# Altium project PCB_Components.PrjPCB
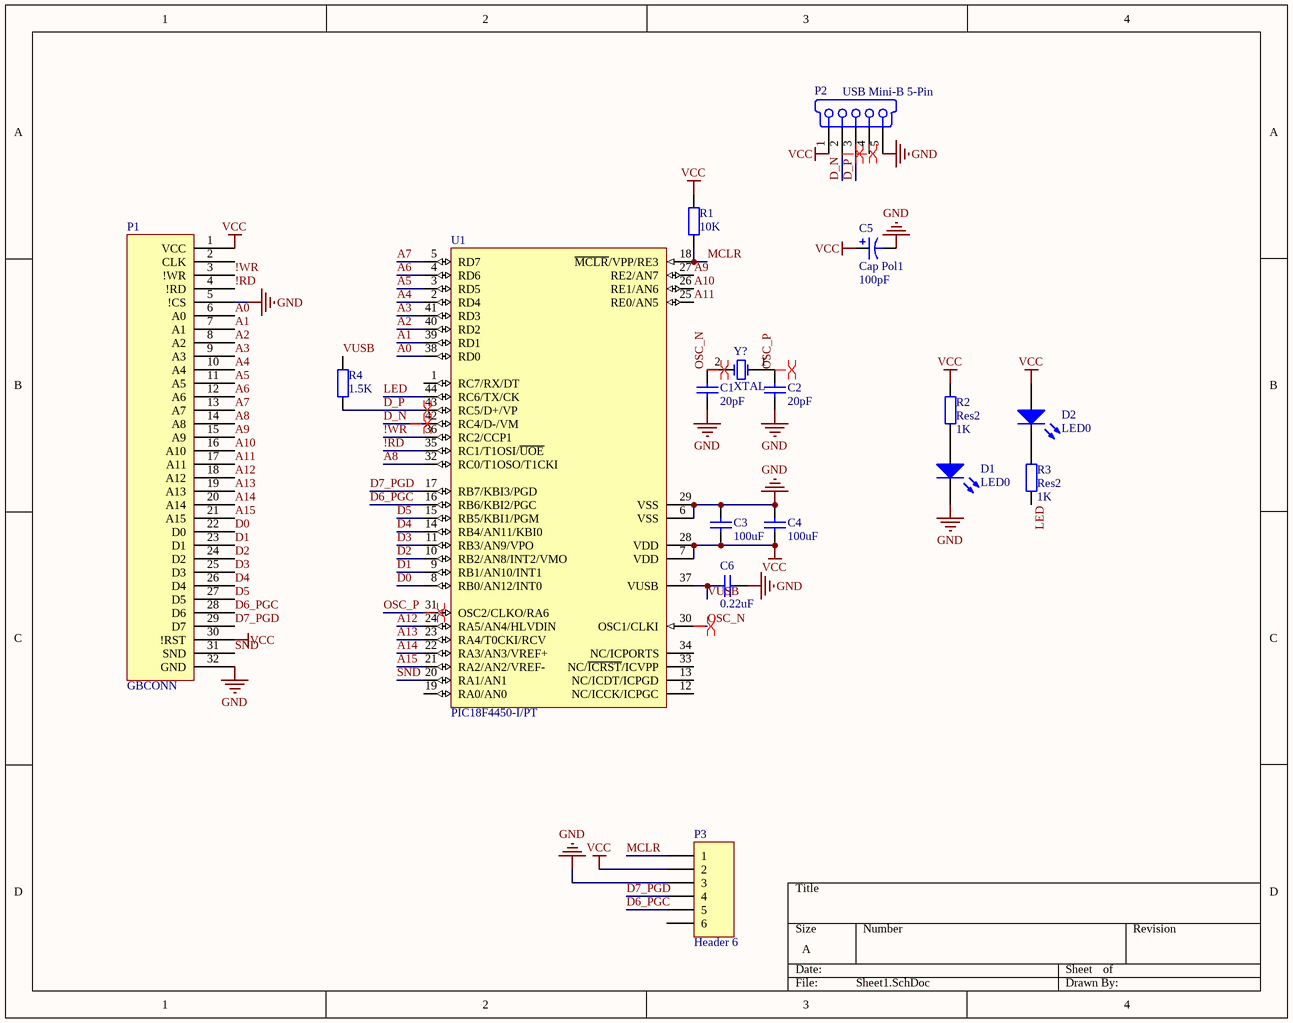
[diagram p0: Sheet1.SchDoc]
1 sheet, 17 parts. Net scope: global (net labels, ports and power ports of the same name join across sheets).
Board file: PCB.PcbDoc

## Sheet Sheet1.SchDoc
size A

### Parts
C1  value 20pF  [6-0805_N]  (hidden comment: Cap)
C2  value 20pF  [6-0805_N]  (hidden comment: Cap)
C3  value 100uF  [6-0805_N]  (hidden comment: Cap)
C4  value 100uF  [6-0805_N]  (hidden comment: Cap)
C5  Cap Pol1  value 100pF  [Capacitor]
C6  value 0.22uF  [6-0805_N]  (hidden comment: Cap)
D1  LED0  [6-0805_N -GREEN]
D2  LED0  [6-0805_N -RED]
P1  GBCONN  [GBCONN]
P2  USB Mini-B 5-Pin  [USB]
P3  Header 6  [HDR1X6]
R1  10K  [6-0805_N -RES]
R2  Res2  value 1K  [6-0805_N -RES]
R3  Res2  value 1K  [6-0805_N -RES]
R4  1.5K  [6-0805_N -RES]
U1  PIC18F4450-I/PT  [TQFP-PT44_N]
Y?  XTAL  [crystal]

### Nets
GND: C1.1 C2.1 C3.1 C4.1 C5.2 C6.2 D1.2(K) P1.5(!CS) P1.32(GND) P2.5(GND) P3.3 U1.6(VSS) U1.29(VSS)
VCC: C3.2 C4.2 C5.1 D2.1(A) P1.1(VCC) P1.30(!RST) P2.1(V_BUS_(5V)) P3.2 R1.2 R2.2 U1.7(VDD) U1.28(VDD)
!RD: P1.4(!RD) U1.35(RC1/T1OSI/~{UOE})
!WR: P1.3(!WR) U1.36(RC2/CCP1)
A0: P1.6(A0) U1.38(RD0)
A1: P1.7(A1) U1.39(RD1)
A2: P1.8(A2) U1.40(RD2)
A3: P1.9(A3) U1.41(RD3)
A4: P1.10(A4) U1.2(RD4)
A5: P1.11(A5) U1.3(RD5)
A6: P1.12(A6) U1.4(RD6)
A7: P1.13(A7) U1.5(RD7)
A8: P1.14(A8) U1.32(RC0/T1OSO/T1CKI)
A9: P1.15(A9) U1.27(RE2/AN7)
A10: P1.16(A10) U1.26(RE1/AN6)
A11: P1.17(A11) U1.25(RE0/AN5)
A12: P1.18(A12) U1.24(RA5/AN4/HLVDIN)
A13: P1.19(A13) U1.23(RA4/T0CKI/RCV)
A14: P1.20(A14) U1.22(RA3/AN3/VREF+)
A15: P1.21(A15) U1.21(RA2/AN2/VREF-)
D0: P1.22(D0) U1.8(RB0/AN12/INT0)
D1: P1.23(D1) U1.9(RB1/AN10/INT1)
D2: P1.24(D2) U1.10(RB2/AN8/INT2/VMO)
D3: P1.25(D3) U1.11(RB3/AN9/VPO)
D4: P1.26(D4) U1.14(RB4/AN11/KBI0)
D5: P1.27(D5) U1.15(RB5/KBI1/PGM)
D6_PGC: P1.28(D6) P3.5 U1.16(RB6/KBI2/PGC)
D7_PGD: P1.29(D7) P3.4 U1.17(RB7/KBI3/PGD)
D_N: P2.2(D-) U1.42(RC4/D-/VM)
D_P: P2.3(D+) R4.1 U1.43(RC5/D+/VP)
LED: R3.1 U1.44(RC6/TX/CK)
MCLR: P3.1 R1.1 U1.18(~{MCLR}/VPP/RE3)
OSC_N: C1.2 U1.30(OSC1/CLKI) Y?.2(OSC2)
OSC_P: C2.2 U1.31(OSC2/CLKO/RA6) Y?.1(OSC1)
SND: P1.31(SND) U1.20(RA1/AN1)
VUSB: C6.1 R4.2 U1.37(VUSB)
NetD1_1: D1.1(A) R2.1
NetD2_2: D2.2(K) R3.2

Not connected (* = marked no-connect by the designer): P1 2(CLK); P2 4(NC); P3 6; U1 1(RC7/RX/DT) 12(NC/ICCK/ICPGC) 13(NC/ICDT/ICPGD) 19(RA0/AN0) 33(NC/~{ICRST}/ICVPP) 34(NC/ICPORTS)

### Layout directives
differential pair: D_N, D_P, OSC_N, OSC_P

### Library data of the parts
C1-C4 C6 = Cap: Capacitor; Published: 8-Jun-2000; LatestRevisionDate: 17-Jul-2002; LatestRevisionNote: Re-released for DXP Platform.; PackageReference: RAD-0.3; Publisher: Altium Limited; PackageDescription: Radial Cap, Thru-Hole; 2 Leads; 0.3 in Pin Spacing
C5 = Cap Pol1: Polarized Capacitor (Radial); Published: 8-Jun-2000; LatestRevisionDate: 17-Jul-2002; LatestRevisionNote: Re-released for DXP Platform.; PackageReference: RB7.6-15; Publisher: Altium Limited; PackageDescription: Polarized Capacitor (Radial); 2 Leads
D1 D2 = LED0: Typical INFRARED GaAs LED; Published: 8-Jun-2000; LatestRevisionDate: 08-Jul-2005; LatestRevisionNote: Mech Layer 1 removed.; PackageReference: LED-0; Publisher: Altium Limited; PackageDescription: LED; 2 Leads
P2 = USB Mini-B 5-Pin: USB On-The-Go (OTG) Mini-B Receptacle, Right Angle, SMT, 0.80mm (.031") Pitch, Solder Tabs with Back Cover, Recessed Type; PCB_Layout: Complies with Manufacturer's Recommendation.; Published: 21-Sep-2007; DatasheetVersion: revA, May-2004; PackageVersion: May-2004; PackageReference: 481900001; Publisher: Altium Limited; PackageDescription: USB Mini-B, Sinking Type, SM; 5 Position; Right Angle, Body 11.45 x 11.8 x 3.9 mm (LxWxH); ComponentLink1Description: Manufacturer Link; ComponentLink1URL: http://www.molex.com/; ComponentLink2Description: Datasheet; ComponentLink2URL: http://www.molex.com/cmc_upload/0/000/895/958/SD-48190-001RevA.pdf
P3 = Header 6: Header, 6-Pin; LatestRevisionDate: 17-Jul-2002; LatestRevisionNote: Re-released for DXP Platform.; Publisher: Altium Limited
R1 R4 = Res2: Resistor; Value: 1K; Published: 8-Jun-2000; LatestRevisionDate: 17-Jul-2002; LatestRevisionNote: Re-released for DXP Platform.; PackageReference: AXIAL-0.4; Publisher: Altium Limited; PackageDescription: Axial Device, Thru-Hole; 2 Leads; 0.4 in Pin Spacing
R2 R3 = Res2: Resistor; Published: 8-Jun-2000; LatestRevisionDate: 17-Jul-2002; LatestRevisionNote: Re-released for DXP Platform.; PackageReference: AXIAL-0.4; Publisher: Altium Limited; PackageDescription: Axial Device, Thru-Hole; 2 Leads; 0.4 in Pin Spacing
U1 = PIC18F4450-I/PT: High Performance, 12 MIPS, Enhanced Flash, USB Microcontroller with nanoWatt Technology, 16K Flash, 44-Pin TQFP, Industrial Temperature Range; Published: 29-Jan-2009; DatasheetVersion: revD, Mar-2008; PackageVersion: revBB, Aug-2009; PackageReference: TQFP-PT44; Publisher: Altium Limited; PackageDescription: 44-Lead Plastic Thin Quad Flatpack (PT) - 10x10x1mm Body, 2.00mm [TQFP]; Supplier 1: Digi-Key; Supplier Part Number 1: PIC18F4450-I/PT-ND; Supplier 2: Farnell; Supplier Part Number 2: 1332265; Code_JEDEC: MS-026; ComponentLink1Description: Datasheet; ComponentLink1URL: http://ww1.microchip.com/downloads/en/DeviceDoc/39760d.pdf; ComponentLink2Description: Packaging Specification; ComponentLink2URL: http://www.microchip.com/stellent/groups/techpub_sg/documents/packagingspec/en012702.pdf; ComponentLink3Description: Microchip.com Home; ComponentLink3URL: http://www.microchip.com/
Y? = XTAL: Crystal Oscillator; Published: 8-Jun-2000; LatestRevisionDate: 17-Jul-2002; LatestRevisionNote: Re-released for DXP Platform.; PackageReference: R38; Publisher: Altium Limited; PackageDescription: Crystal, Thru-Hole; 2 Leads; Body 3.1 x 8.2 mm (Dia.xH)